# EAGLE design PID_Controller (EAGLE 7.1.0)
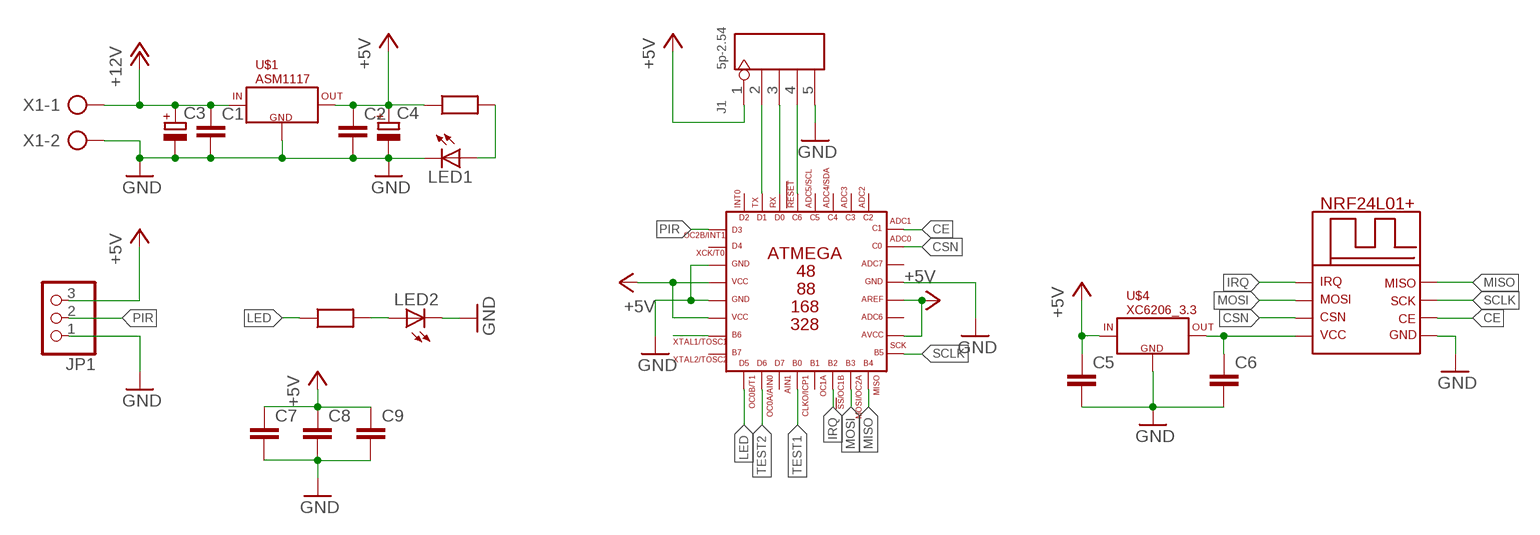
[diagram p0: schematic, sheet 1]

## Parts
C1  C-EUC0805  [C0805]
C2  C-EUC0805  [C0805]
C3  CPOL-EUE2.5-6  [E2,5-6]
C4  CPOL-EUE2.5-6  [E2,5-6]
C5  C-EUC0805  [C0805]
C6  C-EUC0805  [C0805]
C7  C-EUC0805  [C0805]
C8  C-EUC0805  [C0805]
C9  C-EUC0805  [C0805]
J1  5p-2.54  DIP-BLACK-FEMALE-HEADER-VERT(5P-2.54)  [H5-2.54]
JP1  PINHD-1X3  [1X03]
LED1  LEDCHIP-LED0603  [CHIP-LED0603]
LED2  LED3MM  [LED3MM]
R1  RES0603  [R0603]
R2  RES0603  [R0603]
U$1  ASM1117  [SOT223]
U$2  ATMEGAN8  [TQFP32-08]
U$3  NRF24  [NRF]
U$4  XC6206_3.3  [SOT23]
X1  AK500/2  [AK500/2]

## Nets
+5V: C2.1 C4.+ C5.1 C7.1 C8.1 C9.1 J1.1 JP1.3 R1.1 U$1.2(OUT) U$1.4(OUT) U$2.AREF U$2.AVCC U$2.VCC U$2.VCC1 U$4.3(IN)
+12V: C1.1 C3.+ U$1.3(IN) X1.1
CE: U$2.C1 U$3.CE
CSN: U$2.C0 U$3.CSN
GND: C1.2 C2.2 C3.- C4.- C5.2 C6.2 C7.2 C8.2 C9.2 J1.5 JP1.1 LED1.C LED2.K(C) U$1.1(GND) U$2.GND U$2.GND1 U$2.GND2 U$3.GND U$4.1(GND) X1.2
IRQ: U$2.B2 U$3.IRQ
LED: R2.1 U$2.D5
MISO: U$2.B4 U$3.MISO
MOSI: U$2.B3 U$3.MOSI
N$1: LED1.A R1.2
N$2: J1.2 U$2.D1
N$3: J1.3 U$2.D0
N$4: J1.4 U$2.C6
N$5: C6.1 U$3.VCC U$4.2(OUT)
N$6: LED2.A R2.2
N$7: U$2.B6
PIR: JP1.2 U$2.D3
SCLK: U$2.B5 U$3.SCK
TEST1: U$2.B0
TEST2: U$2.D6
Unconnected: U$2.ADC6 U$2.ADC7 U$2.B1 U$2.B7 U$2.C2 U$2.C3 U$2.C4 U$2.C5 U$2.D2 U$2.D4 U$2.D7

## Library data of the parts
C1 C2 C5-C9 = rcl:C-EU: CAPACITOR, European symbol
C3 C4 = rcl:CPOL-EU: POLARIZED CAPACITOR, European symbol
J1 = Seeed-OPL-Connector:DIP-BLACK-FEMALE-HEADER-VERT(5P-2.54): 320030028; MPN: F185-1105A0BSYA1
JP1 = pinhead:PINHD-1X3: PIN HEADER
LED1 LED2 = led:LED: LED OSRAM: - CHIPLED LG R971, LG N971, LY N971, LG Q971, LY Q971, LO R971, LY R971 LH N974, LH R974 LS Q976, LO Q976, LY Q976 LO Q996 - Hyper CHIPLED LW Q18S LB Q993, LB Q99A, LB R99A - SideLED LS A670, LO A670, LY A670, LG A670, LP A670 LB A673, LV A673, LT A673, LW A673 LH A674 LY A675 LS A676, LA A676, LO A676, LY A676, LW A676 LS A679, LY A679, LG A679 - Hyper Micro SIDELED® LS Y876, LA Y876, LO Y876, LY Y876 LT Y87S - SmartLED LW L88C, LW L88S LB L89C, LB L89S, LG L890 LS L89K, LO L89K, LY L89K LS L896, LA L896, LO L896, LY L896 - TOPLED LS T670, LO T670, LY T670, LG T670, LP T670 LSG T670, LSP T670, LSY T670, LOP T670, LYG T670 LG T671, LOG T671, LSG T671 LB T673, LV T673, LT T673, LW T673 LH T674 LS T676, LA T676, LO T676, LY T676, LB T676, LH T676, LSB T676, LW T676 LB T67C, LV T67C, LT T67C, LS T67K, LO T67K, LY T67K, LW E67C LS E67B, LA E67B, LO E67B, LY E67B, LB E67C, LV E67C, LT E67C LW T67C LS T679, LY T679, LG T679 LS T770, LO T770, LY T770, LG T770, LP T770 LB T773, LV T773, LT T773, LW T773 LH T774 LS E675, LA E675, LY E675, LS T675 LS T776, LA T776, LO T776, LY T776, LB T776 LHGB T686 LT T68C, LB T68C - Hyper Mini TOPLED® LB M676 - Mini TOPLED Santana® LG M470 LS M47K, LO M47K, LY M47K Source: http://www.osram.convergy.de LUXEON: - LUMILED® LXK2-PW12-R00, LXK2-PW12-S00, LXK2-PW14-U00, LXK2-PW14-V00 LXK2-PM12-R00, LXK2-PM12-S00, LXK2-PM14-U00 LXK2-PE12-Q00, LXK2-PE12-R00, LXK2-PE12-S00, LXK2-PE14-T00, LXK2-PE14-U00 LXK2-PB12-K00, LXK2-PB12-L00, LXK2-PB12-M00, LXK2-PB14-N00, LXK2-PB14-P00, LXK2-PB14-Q00 LXK2-PR12-L00, LXK2-PR12-M00, LXK2-PR14-Q00, LXK2-PR14-R00 LXK2-PD12-Q00, LXK2-PD12-R00, LXK2-PD12-S00 LXK2-PH12-R00, LXK2-PH12-S00 LXK2-PL12-P00, LXK2-PL12-Q00, LXK2-PL12-R00 Source: www.luxeon.com KINGBRIGHT: KA-3528ASYC Source: www.kingbright.com
R1 R2 = My_RLC:RES0603: Resistor SMD 0603
U$1 = 74xx:ASM1117
U$2 = My Atmel:ATMEGAN8
U$3 = NRF24l01+:NRF24
U$4 = 74xx:XC6206_3.3
X1 = con-ptr500:AK500/2: CONNECTOR; OC_FARNELL: unknown; OC_NEWARK: unknown

## Board
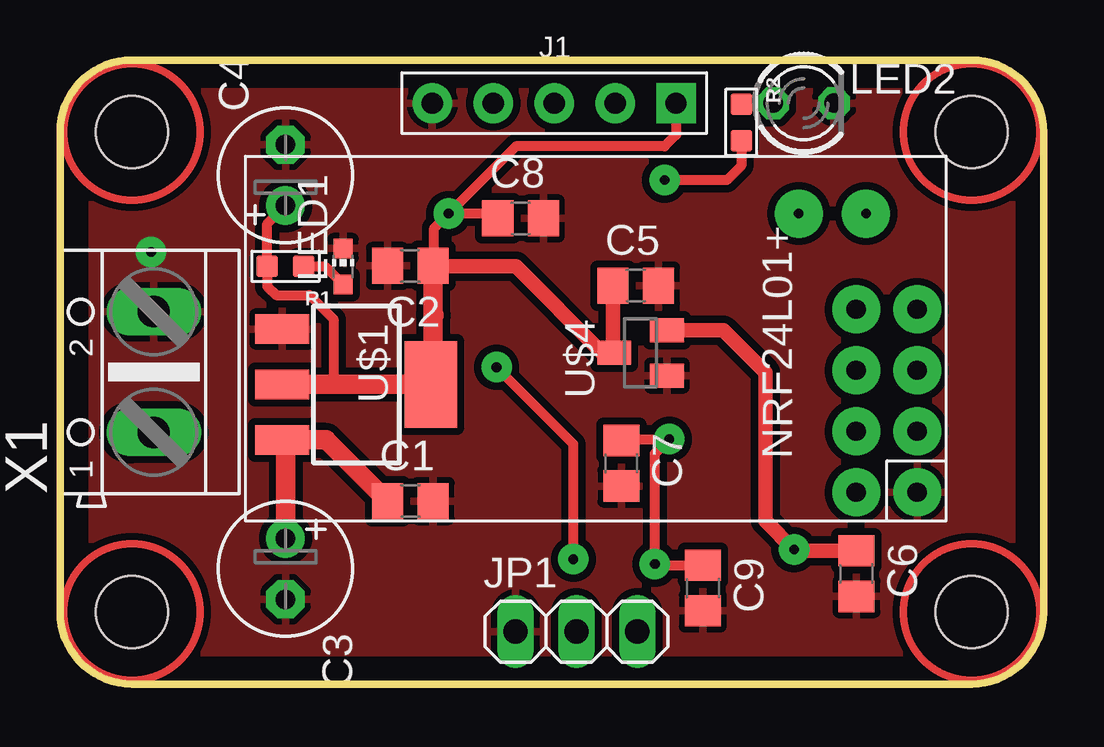
[diagram p1: board, top side]
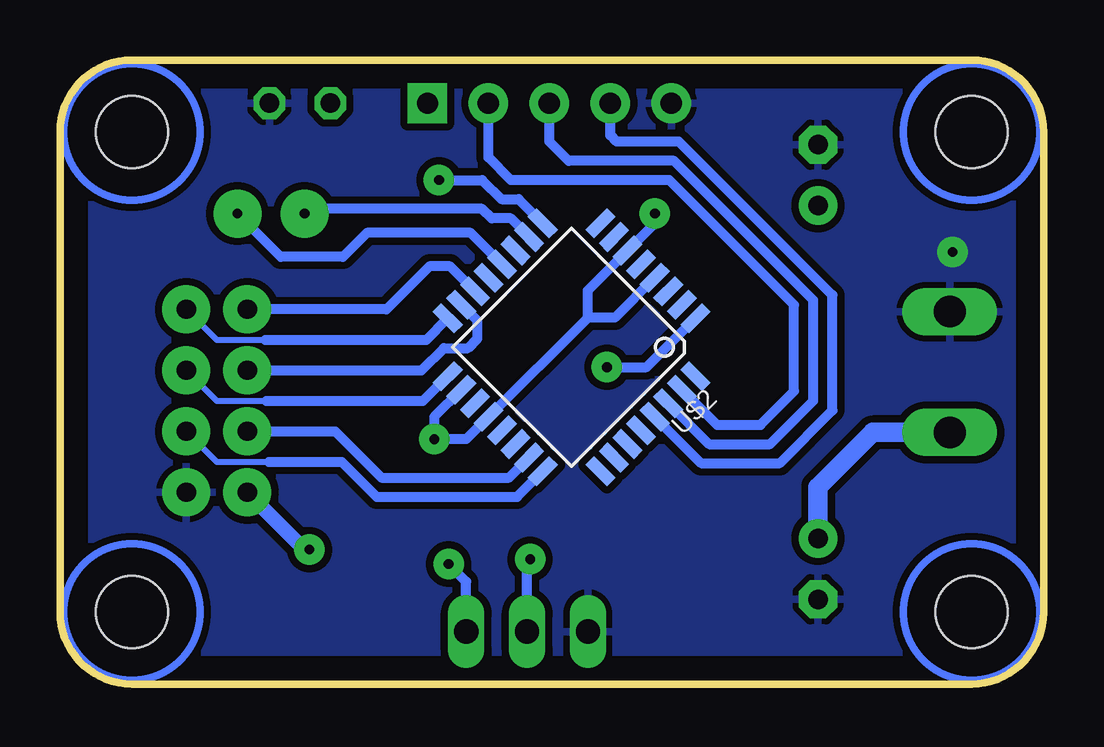
[diagram p2: board, bottom side, seen from below]

Size 41 x 26 mm. Coordinates in mm from the lower left corner, seen from the top.
Outline: 0,3 arc90 3,0 38,0 arc90 41,3 41,23 arc90 38,26 3,26 arc90 0,23 0,3
Copper layers (1*16): Top 0.035mm / dielectric 1.5mm / Bottom 0.035mm
Design rules "default": minimum track width 10mil, minimum drill 24mil, track to track 8mil, track to pad 8mil, pad to pad 8mil, via to via 8mil, smd to smd 8mil, copper to edge 40mil, drill to drill 8mil, minimum pad ring 10mil, minimum via ring 8mil, stop-mask expansion 4mil, vias tented up to drill 0mil, thermal gap 10mil
Holes 3 mm at 3,3 3,23 38,3 38,23

### Footprints (pad centres in the part's own frame; a part is rotated, then mirrored left to right if it is on the bottom)
C0805 = smd 1.3 x 1.5: 1 -0.95,0; 2 0.95,0
E2,5-6 = drill 0.813 pad 1.6: + -1.27,0 | drill 0.813 pad 1.6 octagon: - 1.27,0
H5-2.54 = drill 0.889 pad 1.651 square: 1 0,5.08 | drill 0.889 pad 1.651: 2 0,2.54; 3 0,0; 4 0,-2.54; 5 0,-5.08
1X03 = drill 1.016 long: 1 -2.54,0; 2 0,0; 3 2.54,0
CHIP-LED0603 = smd 0.8 x 0.8: A 0,-0.75; C 0,0.75
LED3MM = drill 0.813 octagon: A -1.27,0; K 1.27,0
R0603 = smd 0.889 x 0.889: 1 0,0.762; 2 0,-0.762
SOT223 = smd 1.219 x 2.235: 1 -2.311,-3.099; 2 0,-3.099; 3 2.311,-3.099 | smd 3.6 x 2.2: 4 0,3.099
TQFP32-08 = smd 1.27 x 0.508: ADC6 4.5,-1.2; ADC7 4.5,1.2; AREF 4.5,-0.4; AVCC 4.5,-2; B5 4.5,-2.8; B6 -4.5,-2; B7 -4.5,-2.8; C0 4.5,2; C1 4.5,2.8; D3 -4.5,2.8; D4 -4.5,2; GND 4.5,0.4; GND1 -4.5,-0.4; GND2 -4.5,1.2; VCC -4.5,-1.2; VCC1 -4.5,0.4 | smd 0.508 x 1.27: B0 -0.4,-4.5; B1 0.4,-4.5; B2 1.2,-4.5; B3 2,-4.5; B4 2.8,-4.5; C2 2.8,4.5; C3 2,4.5; C4 1.2,4.5; C5 0.4,4.5; C6 -0.4,4.5; D0 -1.2,4.5; D1 -2,4.5; D2 -2.8,4.5; D5 -2.8,-4.5; D6 -2,-4.5; D7 -1.2,-4.5
NRF = drill 0.8 pad 2: CE 3.74,1.2; CSN 3.74,3.74; GND 1.2,1.2; IRQ 8.82,3.74; MISO 8.82,1.2; MOSI 6.28,3.74; SCK 6.28,1.2; VCC 1.2,3.74
SOT23 = smd 1 x 1.4: 1 -0.95,-1.1; 2 0.95,-1.1; 3 0,1.1
AK500/2 = drill 1.321 long: 1 -2.515,0; 2 2.515,0

### Placement (x,y rotation side)
C1  14.6,7.62 0 top
C2  14.6,17.42 180 top
C3  9.4,4.8 270 top
C4  9.4,21.2 90 top
C5  24,16.6 0 top
C6  33.2,4.6 270 top
C7  23.4,9.2 270 top
C8  19.2,19.4 0 top
C9  26.8,4 270 top
J1  20.6,24.2 270 top
JP1  21.53,2.18 0 top
LED1  11.8,17.4 0 top
LED2  31,24.2 0 top
R1  9.4,17.4 90 top
R2  28.4,23.4 180 top
U$1  12.36,12.48 270 top
U$2  19.67,14.03 225 bottom
U$3  36.93,6.79 90 top
U$4  24.2,13.8 90 top
X1  3.91,13 90 top

### Tracks (layer width: path | path; a pad name or v marks a point on that pad's centre or on a via)
+5V  (via drill 0.4 pad 1.27)
  Top 0.406: 11.4,12.48 11.4,15.2 10.4,16.2 9,16.2 8.64,16.56 R1.1 8.64,19.17 C4.+ | C2.1 15.6,17.47 15.6,19 v16.2,19.6 | J1.1 25.68,22.88 25.2,22.4 19,22.4 v16.2,19.6 | C7.1 23.45,10.2 v25.4,10.2 24.8,9.6 v24.8,5 24.85,4.95 C9.1 | C8.1 18.05,19.6 v16.2,19.6
  Top 0.61: C2.1 15.57,17.4 19,17.4 22.6,13.8 U$4.3 23.05,13.85 C5.1
  Top 0.813: U$1.2 11.4,12.48 U$1.4 15.55,12.57 15.55,15.4 | C2.1 15.55,15.4 | 15.59,15.36 15.55,15.4
  Bottom 0.406: U$2.AVCC 25.4,11.13 v25.4,10.2 24.07,10.2 U$2.AREF 19,15.27 | JP1.3 24.07,4.27 v24.8,5 | 19,15.27 19,16.4 U$2.VCC 16.2,19.2 v16.2,19.6 | U$2.VCC1 17.87,15.27 19,15.27
+12V
  Top 0.813: C3.+ 9.4,10.03 U$1.3 11.1,10.17 C1.1
  Bottom 0.813: X1.1 7.12,10.48 9.4,8.2 C3.+
CE
  Bottom 0.254: U$3.CE 34.46,9.26 32.29,9.26
  Bottom 0.406: 32.29,9.26 29.26,9.26 27.8,7.8 21.95,7.8 U$2.C1
CSN
  Bottom 0.406: U$3.CSN 29.53,10.53 27.6,8.6 22.28,8.6 U$2.C0
GND  (via drill 0.4 pad 1.27)
  other vias: 3.8,18
  pour Top (isolate 0.305): 0,0 41,0 41,26 0,26
  pour Bottom (isolate 0.305): 41,0 0,0 0,26 41,26
IRQ
  Bottom 0.406: U$2.B2 24.74,17.4 25.6,17.4 27.39,15.61 U$3.IRQ
LED  (via drill 0.4 pad 1.27)
  Top 0.406: R2.1 28.4,21.6 27.8,21 v25.2,21
  Bottom 0.406: v25.2,21 23.4,21 22.6,20.2 21.88,20.2 U$2.D5
MISO
  Bottom 0.254: U$3.MISO 34.46,14.34 32.44,14.34
  Bottom 0.406: 32.44,14.34 25.73,14.34 U$2.B4
MOSI
  Bottom 0.406: U$3.MOSI 25.93,13.07 25,14 24,14 23.6,14.4 23.6,15.13 U$2.B3
N$1
  Top 0.406: R1.2 11.05,17.4 LED1.A
N$2
  Bottom 0.406: U$2.D1 13.61,10.8 11.8,10.8 10.4,12.2 10.4,15.8 15.6,21 22.2,21 23.14,21.94 J1.2
N$3
  Bottom 0.406: U$2.D0 13.95,10 11.4,10 9.6,11.8 9.6,16 15.4,21.8 19.8,21.8 20.6,22.6 J1.3
N$4
  Bottom 0.406: U$2.C6 14.28,9.2 11,9.2 8.8,11.4 8.8,16.2 15.2,22.6 17.8,22.6 18.06,22.86 J1.4
N$5  (via drill 0.4 pad 1.27)
  Top 0.61: U$4.2 27.65,14.75 29.4,13 29.4,6.8 v30.6,5.6 30.65,5.55 C6.1
  Bottom 0.61: v30.6,5.6 30.8,5.6 U$3.VCC
N$6
  Top 0.61: LED2.A 28.44,24.2 R2.2
PIR  (via drill 0.4 pad 1.27)
  Top 0.406: v21.4,5.2 21.4,10 v18.2,13.2
  Bottom 0.406: JP1.2 21.53,5.07 v21.4,5.2 | v18.2,13.2 16.55,13.2 U$2.D3
SCLK
  Bottom 0.254: U$3.SCK 34.46,11.8 32.4,11.8
  Bottom 0.406: 32.4,11.8 25.86,11.8 U$2.B5
TEST1  (via drill 0.4 pad 2)
  Bottom 0.406: U$2.B0 23.88,18.8 28.2,18.8 29.2,17.8 31.8,17.8 v33.6,19.6
TEST2  (via drill 0.4 pad 2)
  Bottom 0.406: U$2.D6 22.2,19.4 23,19.4 23.4,19.8 30.6,19.8 v30.8,19.6
(copper drawn outside any net)
  shapes: Bottom circle x4, Top circle x4